# EAGLE design DAQ (EAGLE 7.2.0)
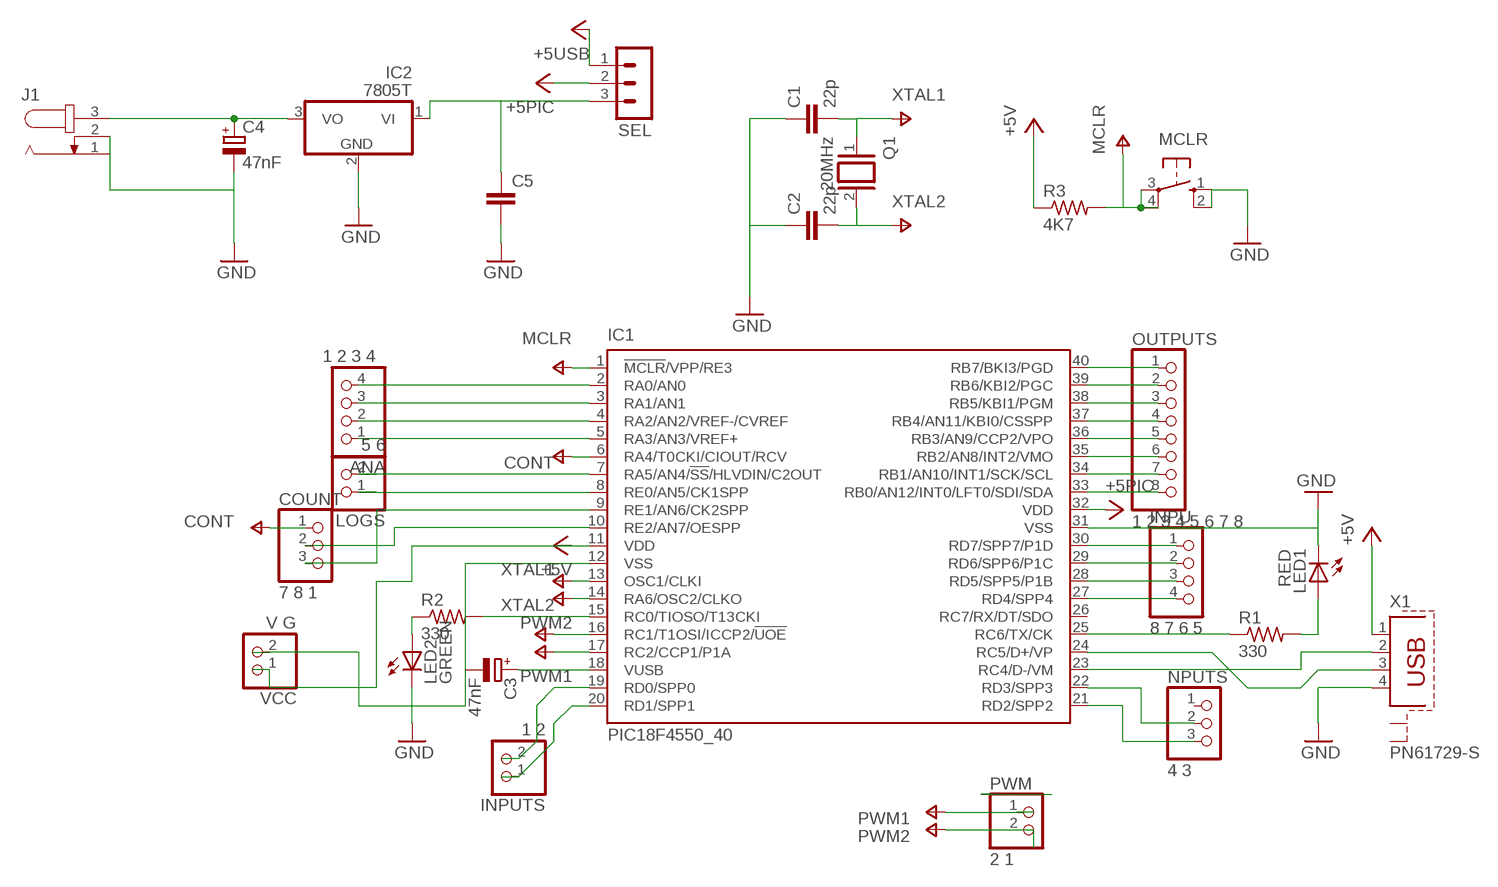
[diagram p0: schematic, sheet 1]

## Parts
ANA  1 2 3 4  PINHD-1X4  [1X04]
C1  22p  C-EU025-024X044  [C025-024X044]
C2  22p  C-EU025-024X044  [C025-024X044]
C3  47nF  CPOL-EUE2,5-6E  [E2,5-6E]
C4  47nF  CPOL-EUE2,5-6E  [E2,5-6E]
C5  C-EU050-035X075  [C050-035X075]
COUNT  7 8 1  PINHD-1X3  [1X03]
IC1  PIC18F4550_40  [DIL40]
IC2  7805T  [TO220H]
INPU  8 7 6 5  PINHD-1X4  [1X04]
INPUTS  1 2  PINHD-1X2  [1X02]
J1  JACK-PLUG0  [SPC4077]
LED1  RED  TLLR4400  [LED3MM]
LED2  GREEN  TLLG4400  [LED3MM]
LOGS  5 6  PINHD-1X2  [1X02]
MCLR  10-XX  [B3F-10XX]
NPUTS  4 3  PINHD-1X3  [1X03]
OUTPUTS  1 2 3 4 5 6 7 8  PINHD-1X8  [1X08]
PWM  2 1  PINHD-1X2  [1X02]
Q1  20MHz  XTAL/S  [QS]
R1  330  R-US_0207/10  [0207/10]
R2  330  R-US_0207/10  [0207/10]
R3  4K7  R-US_0207/10  [0207/10]
SEL  MA03-1  [MA03-1]
VCC  V G  PINHD-1X2  [1X02]
X1  PN61729-S  [PN61729-S]

## Nets
+5PIC: IC1.11(VDD) IC1.32(VDD) R3.1 SEL.2 VCC.1 ; supply symbol labelled +5V
+5USB: SEL.1 X1.1 ; supply symbol labelled +5V
CONT: COUNT.1 IC1.6(RA4/T0CKI/CIOUT/RCV)
GND: C1.1 C2.1 C3.- C4.- C5.2 IC1.12(VSS) IC1.31(VSS) IC2.2(GND) J1.1 J1.2 LED1.K(C) LED2.K(C) MCLR.1(S) MCLR.2(S1) VCC.2 X1.4
MCLR: IC1.1(!MCLR!/VPP/RE3) MCLR.3(P) MCLR.4(P1) R3.2
N$1: IC1.23(RC4/D-/VM) X1.2
N$2: IC1.30(RD7/SPP7/P1D) INPU.1
N$3: IC1.40(RB7/BKI3/PGD) OUTPUTS.1
N$4: IC1.15(RC0/TIOSO/T13CKI) R2.2
N$5: LED2.A R2.1
N$6: IC1.25(RC6/TX/CK) R1.1
N$7: LED1.A R1.2
N$8: IC1.39(RB6/KBI2/PGC) OUTPUTS.2
N$9: IC1.38(RB5/KBI1/PGM) OUTPUTS.3
N$10: IC1.37(RB4/AN11/KBI0/CSSPP) OUTPUTS.4
N$11: IC1.36(RB3/AN9/CCP2/VPO) OUTPUTS.5
N$12: IC1.35(RB2/AN8/INT2/VMO) OUTPUTS.6
N$13: IC1.34(RB1/AN10/INT1/SCK/SCL) OUTPUTS.7
N$14: IC1.33(RB0/AN12/INT0/LFT0/SDI/SDA) OUTPUTS.8
N$15: IC1.24(RC5/D+/VP) X1.3
N$16: IC1.29(RD6/SPP6/P1C) INPU.2
N$17: IC1.28(RD5/SPP5/P1B) INPU.3
N$18: IC1.27(RD4/SPP4) INPU.4
N$19: IC1.19(RD0/SPP0) INPUTS.2
N$20: C3.+ IC1.18(VUSB)
N$21: IC1.21(RD2/SPP2) NPUTS.3
N$22: IC1.22(RD3/SPP3) NPUTS.2
N$23: ANA.4 IC1.2(RA0/AN0)
N$24: ANA.3 IC1.3(RA1/AN1)
N$25: ANA.2 IC1.4(RA2/AN2/VREF-/CVREF)
N$26: ANA.1 IC1.5(RA3/AN3/VREF+)
N$27: IC1.7(RA5/AN4/!SS!/HLVDIN/C2OUT) LOGS.2
N$28: IC1.8(RE0/AN5/CK1SPP) LOGS.1
N$29: IC1.20(RD1/SPP1) INPUTS.1
N$31: COUNT.3 IC1.9(RE1/AN6/CK2SPP)
N$32: COUNT.2 IC1.10(RE2/AN7/OESPP)
N$131: C4.+ IC2.3(VO) J1.3
N$132: C5.1 IC2.1(VI) SEL.3
PWM1: IC1.17(RC2/CCP1/P1A) PWM.1
PWM2: IC1.16(RC1/T1OSI/ICCP2/!UOE) PWM.2
XTAL1: C1.2 IC1.13(OSC1/CLKI) Q1.1
XTAL2: C2.2 IC1.14(RA6/OSC2/CLKO) Q1.2
Unconnected: IC1.26(RC7/RX/DT/SDO) NPUTS.1 X1.S1 X1.S2

## Library data of the parts
ANA INPU = pinhead:PINHD-1X4: PIN HEADER
C1 C2 C5 = rcl:C-EU: CAPACITOR, European symbol
C3 C4 = resistor:CPOL-EU: POLARIZED CAPACITOR, European symbol
COUNT NPUTS = pinhead:PINHD-1X3: PIN HEADER
IC1 = microchip:PIC18F4*_40: USB Microcontrollers with nanoWatt Technology High-Performance, Enhanced Flash, 28/40/44-Pin, Source: http://ww1.microchip.com/downloads/en/devicedoc/39632c.pdf; MF: MICROCHIP; MPN: PIC18F4550-I/P; OC_FARNELL: 9321357; OC_NEWARK: 74K8623
IC2 = linear:78*: Positive VOLTAGE REGULATOR Source: http://cache.national.com/ds/LM/LM78L05.pdf http://www.fairchildsemi.com/ds/LM/LM7805.pdf
INPUTS LOGS PWM VCC = pinhead:PINHD-1X2: PIN HEADER
J1 = con-jack:JACK-PLUG: DC POWER JACK Power Jack, DC, Right Angle, Through Hole, Rated 5A at 16VDC, PC Terminals Distributor: Farnell (www.Farnell.de) Drawing: 84N1161.pdf / 84N1162.pdf Manufacturer: SPC Technology (www.spctechnology.com) Type: SPC4077 / SPC 4078; OC_FARNELL: unknown; OC_NEWARK: unknown
LED1 = led:TLLR4400: Low Current (2mA) LED 3 mm Tinted Diffused Package color RED Source: Data sheet <http://www.farnell.com/datasheets/391100.pdf>; MF: VISHAY SEMICONDUCTOR; OC_FARNELL: 1612437
LED2 = led:TLLG4400: Low Current (2mA) LED 3 mm Tinted Diffused Package color GREEN Source: Data sheet <http://www.farnell.com/datasheets/391098.pdf>; MF: VISHAY SEMICONDUCTOR; OC_FARNELL: 1612435
MCLR = switch-omron:10-XX: OMRON SWITCH; MPN: B3F-1000; OC_FARNELL: 176432; OC_NEWARK: 36M3542
OUTPUTS = pinhead:PINHD-1X8: PIN HEADER
Q1 = special:XTAL/S: CRYSTAL
R1-R3 = resistor:R-US_: RESISTOR, American symbol
SEL = con-lstb:MA03-1: PIN HEADER; OC_FARNELL: unknown; OC_NEWARK: unknown
X1 = con-berg:PN61729-S: BERG USB connector; OC_FARNELL: unknown; OC_NEWARK: unknown

## Board
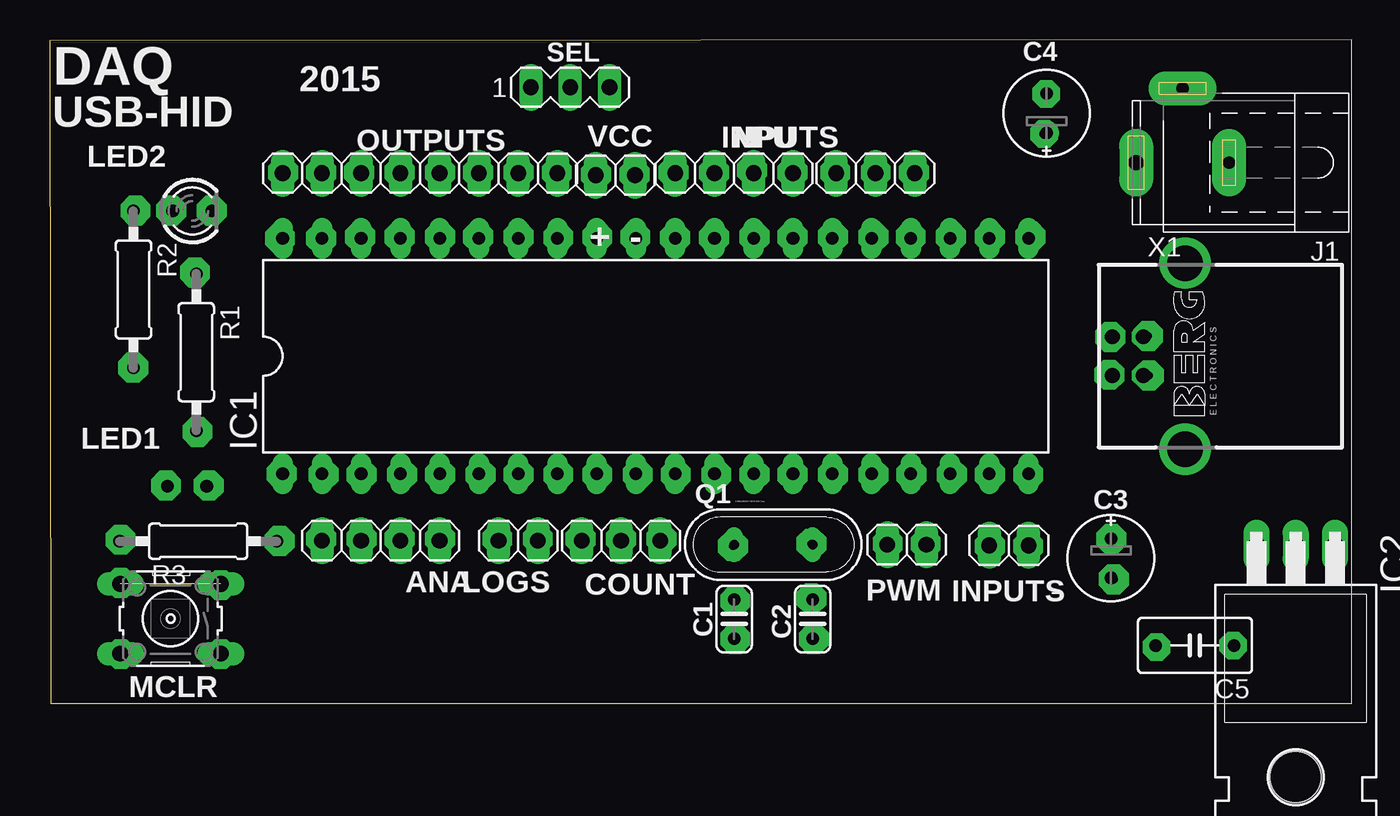
[diagram p1: board, top side]
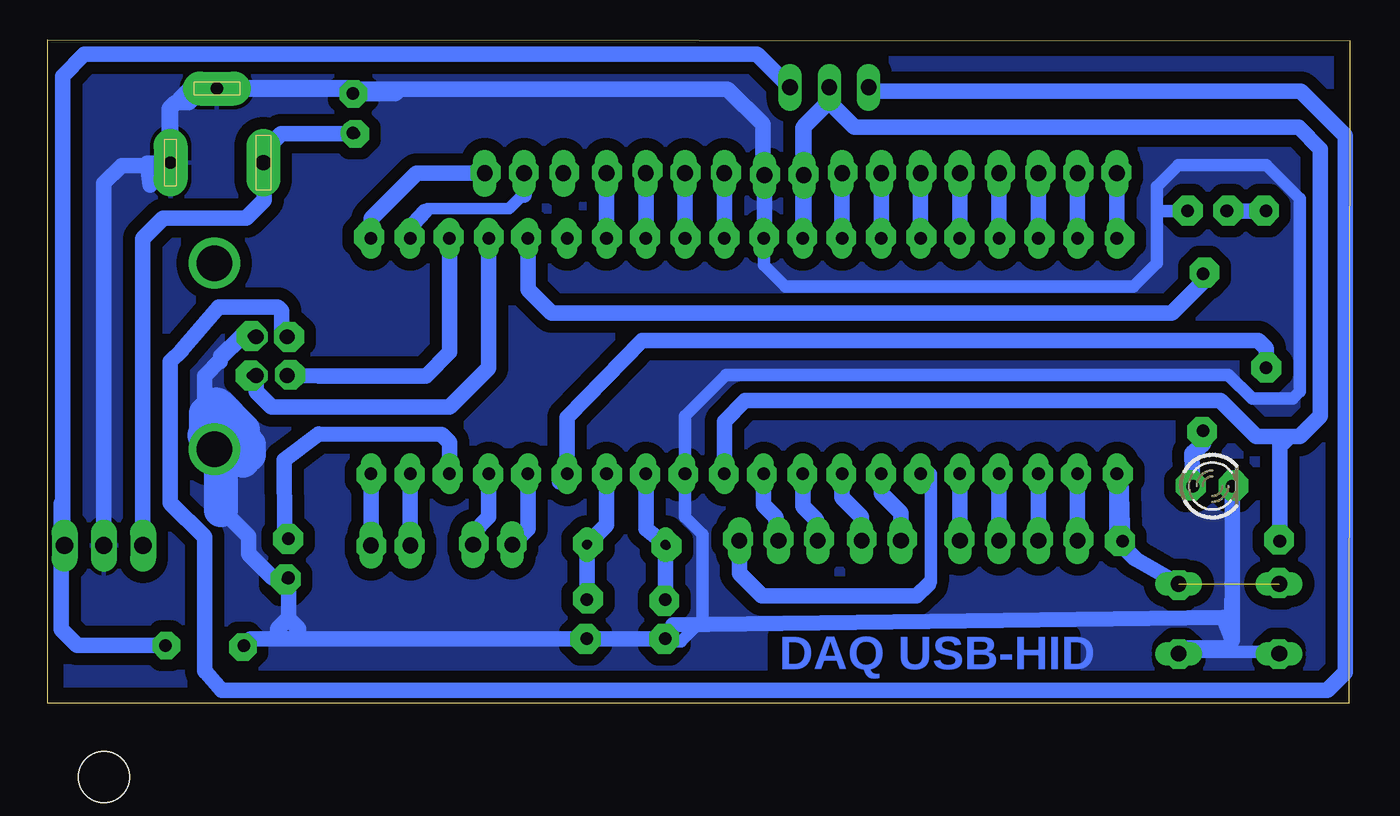
[diagram p2: board, bottom side, seen from below]

Size 84.24 x 42.93 mm. Coordinates in mm from the lower left corner, seen from the top.
Outline: 0.08,0 84.24,0 84.24,42.93 0,42.86 0.08,0
Copper layers (1*16): Top 0.035mm / dielectric 1.5mm / Bottom 0.035mm
Design rules "default *": minimum track width 10mil, minimum drill 24mil, track to track 30mil, track to pad 30mil, pad to pad 30mil, via to via 30mil, smd to smd 30mil, copper to edge 40mil, drill to drill 8mil, minimum pad ring 10mil, minimum via ring 8mil, stop-mask expansion 4mil, vias tented up to drill 0mil, thermal gap 10mil

### Footprints (pad centres in the part's own frame; a part is rotated, then mirrored left to right if it is on the bottom)
1X04 = drill 1.016 long: 1 -3.81,0; 2 -1.27,0; 3 1.27,0; 4 3.81,0
C025-024X044 = drill 0.813 octagon: 1 -1.27,0; 2 1.27,0
E2,5-6E = drill 0.813 pad 1.575: + -1.27,0 | drill 0.813 pad 1.575 octagon: - 1.27,0
C050-035X075 = drill 0.813 octagon: 1 -2.54,0; 2 2.54,0
1X03 = drill 1.016 long: 1 -2.54,0; 2 0,0; 3 2.54,0
DIL40 = drill 0.813 long: 1 -24.13,-7.62; 2 -21.59,-7.62; 3 -19.05,-7.62; 4 -16.51,-7.62; 5 -13.97,-7.62; 6 -11.43,-7.62; 7 -8.89,-7.62; 8 -6.35,-7.62; 9 -3.81,-7.62; 10 -1.27,-7.62; 11 1.27,-7.62; 12 3.81,-7.62; 13 6.35,-7.62; 14 8.89,-7.62; 15 11.43,-7.62; 16 13.97,-7.62; 17 16.51,-7.62; 18 19.05,-7.62; 19 21.59,-7.62; 20 24.13,-7.62; 21 24.13,7.62; 22 21.59,7.62; 23 19.05,7.62; 24 16.51,7.62; 25 13.97,7.62; 26 11.43,7.62; 27 8.89,7.62; 28 6.35,7.62; 29 3.81,7.62; 30 1.27,7.62; 31 -1.27,7.62; 32 -3.81,7.62; 33 -6.35,7.62; 34 -8.89,7.62; 35 -11.43,7.62; 36 -13.97,7.62; 37 -16.51,7.62; 38 -19.05,7.62; 39 -21.59,7.62; 40 -24.13,7.62
TO220H = drill 1.118 long: 1 -2.54,-10.16; 2 0,-10.16; 3 2.54,-10.16 | hole 3.302: 0,4.826
1X02 = drill 1.016 long: 1 -1.27,0; 2 1.27,0
SPC4077 = drill 0.8 pad 2.184 long: 1 -3,0; 2 0,-4.8 | drill 1 pad 2.184 long: 3 3,0
LED3MM = drill 0.813 octagon: A -1.27,0; K 1.27,0
B3F-10XX = drill 1.016 long: 1 -3.251,2.261; 2 3.251,2.261; 3 -3.251,-2.261; 4 3.251,-2.261
1X08 = drill 1.016 long: 1 -8.89,0; 2 -6.35,0; 3 -3.81,0; 4 -1.27,0; 5 1.27,0; 6 3.81,0; 7 6.35,0; 8 8.89,0
QS = drill 0.61 long: 1 -2.54,0; 2 2.54,0
0207/10 = drill 0.813 octagon: 1 -5.08,0; 2 5.08,0
MA03-1 = drill 1.016 long: 1 -2.54,0; 2 0,0; 3 2.54,0
PN61729-S = drill 0.95 octagon: 1 1.25,4.71; 2 -1.25,4.71; 3 -1.25,2.71; 4 1.25,2.71 | drill 2.3 pad 2.9: S1 -6.02,0; S2 6.02,0

### Placement (x,y rotation side)
ANA  21.42,10.52 180 top
C1  44.28,5.44 90 top
C2  49.36,5.44 90 top
C3  68.66,9.37 270 top
C4  64.5,38.18 90 top
C5  74.1,3.73 180 top
COUNT  36.96,10.52 180 top
IC1  39.2,22.45 0 top
IC2  80.61,0.04 180 top
INPU  44.28,34.29 0 top
INPUTS  62.06,10.21 180 top
J1  73.3,34.98 180 top
LED1  8.89,14.05 0 bottom
LED2  9.23,31.85 0 top
LOGS  30.31,10.52 180 top
MCLR  7.82,5.46 180 top
NPUTS  53.42,34.29 0 top
OUTPUTS  23.96,34.29 0 top
PWM  55.46,10.26 180 top
Q1  46.82,10.26 0 top
R1  9.48,22.71 270 top
R2  5.42,26.77 270 top
R3  9.61,10.48 0 top
SEL  33.68,39.85 0 top
VCC  36.6,34.16 0 top
X1  73.46,22.45 90 top

### Tracks (layer width: path | path; a pad name or v marks a point on that pad's centre or on a via)
+5PIC
  Bottom 1.016: SEL.2 33.68,38.98 35.31,37.34 35.31,34.18 VCC.1 35.33,30.14 IC1.32 35.39,37.22 33.56,39.05 | IC1.11 40.47,18.24 39.12,19.58 8.38,19.58 6.05,17.26 3.92,17.26 | 3.92,17.26 3.23,17.26 1.9,18.59 1.9,35.85 3.31,37.26 32.04,37.26 33.56,38.79 33.56,39.05 | R3.1 4.53,16.65 3.92,17.26 | 33.56,39.05 33.56,39.47
+5USB
  Bottom 1.016: SEL.1 30.89,39.85 30.63,39.59 3.16,39.59 0.3,36.73 0.3,1.98 1.44,0.84 73,0.84 73.99,1.98 74.1,2.1 74.1,10.74 76.31,12.95 76.31,22.1 75.59,22.82 75.59,22.86 73.19,25.64 69.38,25.64 69.11,25.37 69.11,24.06 X1.1
CONT
  Bottom 0.813: IC1.6 27.11,14.83 27.11,7.85 27.26,7.7
  Bottom 1.016: COUNT.1 39.5,8.38 38.04,6.93 28.03,6.93 27.26,7.7
GND
  Bottom 0.813: C1.1 44.11,4 43.28,4 41.89,5.39 41.89,10.93 43.01,12.05 IC1.12 43.01,18.59 40.35,21.25 7.86,21.25 6.32,19.71 3.7,19.71 3.24,20.17 3.24,32.64 5.4,34.8 11.09,34.8 12.48,33.41 12.48,32.03 | 12.48,32.03 12.48,28.49 14.02,26.95 36.5,26.95 37.89,28.33 37.89,30.03 IC1.31 | LED1.K 7.77,3.69 | 7.77,3.69 8.13,3.32 10.95,3.32 MCLR.1 | 7.77,3.69 10.85,3.69 11.21,3.32 4.69,3.32 MCLR.2 | LED2.K 12.3,31.85 12.48,32.03
  Bottom 1.016: X1.4 71.81,23.7 | 71.81,23.7 73.06,22.45 | VCC.2 37.87,33.6 | 37.87,33.6 37.87,30.14 IC1.31 | LED1.K 7.62,4.08 8.19,5.56 43.77,5.07 C1.1 C2.1 68.96,4.17 | 64.91,39.81 73.26,39.81 J1.2 73.49,39.59 75.2,39.59 76.3,38.49 J1.1 76.34,34.94 76.65,34.94 | 77.61,33.53 77.8,34.94 76.65,34.94 | 76.65,34.94 76.39,35.2 76.39,35.47 | 76.39,35.47 76.39,38.48 76.01,38.86 75.13,38.86 74.25,39.74 61.49,39.74 | 61.49,39.74 40.27,39.74 37.98,37.45 37.98,33.72 37.87,33.6 | IC2.2 80.62,33.64 79.47,34.79 77.07,34.79 76.39,35.47 | 68.96,4.17 71.13,4.17 C5.2 | 68.61,5.41 68.66,5.46 C3.- 69.71,8.1 71.24,9.64 71.24,10.78 72.88,12.42 72.96,12.42 | 68,4.8 68.61,5.41 | 68.61,5.41 68.77,5.41 69.38,4.8 69.38,4.58 68.96,4.17 | 71.81,23.7 71.81,23.63 73.03,22.4 | 74.1,17.34 74.1,21.18 73.07,22.21 | 73.07,22.21 73.07,22.29 71.62,23.74 | 73.07,22.1 73.07,22.21 | 71.62,23.74 71.43,23.93 71.05,23.93 70.86,23.74 71.62,23.74 | 72.96,12.42 73.03,12.42 73.15,12.53 73.07,12.53 72.96,12.42 | C4.- 61.78,39.45 61.49,39.74
  Bottom 2.184: 73.03,12.47 73.03,16.95 72,17.98 72,17.49 71.24,16.73 71.24,16.08 71.62,15.7 71.62,17.68 73.26,19.32 73.45,19.32 74.02,18.75 74.02,17.41 74.1,17.34
  pour Bottom: -0.86,42.95 -1.17,-0.14 84.12,-0.18 84.42,42.91
MCLR  (1 unrouted)
  Bottom 1.016: R3.2 14.82,14.58 IC1.1 15.07,10.52 13.88,9.32 MCLR.3
N$1
  Bottom 1.016: IC1.23 58.25,22.71 59.77,21.18 66.73,21.18 X1.2
N$2
  Bottom 1.016: INPU.1 IC1.30
N$3
  Bottom 1.016: OUTPUTS.1 IC1.40
N$4
  Bottom 1.016: R2.2 5.42,22.96 5.93,23.47 45.8,23.47 50.63,18.49 IC1.15 51.14,14.33
N$5
  Bottom 1.016: R2.1 LED2.A
N$6
  Bottom 1.016: R1.1 9.48,27.28 11.51,25.25 51.65,25.25 53.17,26.77 IC1.25
N$7
  Bottom 1.016: R1.2 9.48,16.76 10.23,16.17 LED1.A
N$8
  Bottom 1.016: OUTPUTS.2 IC1.39
N$9
  Bottom 1.016: OUTPUTS.3 IC1.38
N$10
  Bottom 1.016: OUTPUTS.4 IC1.37
N$11
  Bottom 1.016: OUTPUTS.5 IC1.36
N$12
  Bottom 1.016: OUTPUTS.6 IC1.35
N$13
  Bottom 1.016: OUTPUTS.7 IC1.34
N$14
  Bottom 1.016: OUTPUTS.8 IC1.33
N$15
  Bottom 1.016: IC1.24 55.71,21.69 58.25,19.15 69.76,19.15 70.76,20.15 X1.3
N$16
  Bottom 1.016: INPU.2 IC1.29
N$17
  Bottom 1.016: INPU.3 IC1.28
N$18
  Bottom 1.016: INPU.4 IC1.27
N$19
  Bottom 1.016: IC1.19 INPUTS.2
N$20
  Bottom 1.016: IC1.18 58.25,16.87 58.76,17.37 66.71,17.41 68.96,15.74 68.92,11.28 68.66,11.02 C3.+
N$21
  Bottom 1.016: 63.33,29.57 IC1.21 63.33,31.34 60.38,34.29 NPUTS.3
N$22
  Bottom 0.61: 53.42,32.87 53.68,32.87 53.68,32.72 | 59.67,32 59.88,31.8
  Bottom 0.75: 53.68,32.72 54.39,32 59.67,32
  Bottom 1.016: NPUTS.2 53.42,32.87 | 59.88,31.8 60.89,30.68 60.89,30.18 IC1.22
N$23
  Bottom 1.016: IC1.2 ANA.4
N$24
  Bottom 1.016: IC1.3 ANA.3
N$25
  Bottom 1.016: IC1.4 ANA.2
N$26
  Bottom 1.016: IC1.5 ANA.1
N$27
  Bottom 1.016: IC1.7 30.31,13.56 29.04,12.29 LOGS.2
N$28
  Bottom 1.016: IC1.8 32.85,13.31 31.58,12.04 LOGS.1
N$29
  Bottom 1.016: IC1.20 INPUTS.1
N$30
  pour Bottom: -0.6,43.24 -0.68,-0.18 84.32,-0.29 84.4,43.13
N$31
  Bottom 1.016: IC1.9 35.39,12.74 34.5,11.85 34.5,10.6 COUNT.3
N$32
  Bottom 1.016: IC1.10 37.93,12.82 37.12,12.01 37.12,10.36 | 37.12,9.85 37.12,10.36 | 37.12,10.36 COUNT.2
N$33  (via drill 0.5 pad 1.93)
  other vias: 14.9,30.08
N$34  (via drill 0.5 pad 1.93)
  other vias: 17.56,30.08
N$35  (via drill 0.5 pad 1.93)
  other vias: 20.08,30.18
N$36  (via drill 0.5 pad 1.93)
  other vias: 68.63,23.7
N$37  (via drill 0.5 pad 1.93)
  other vias: 71.06,23.76
N$38  (via drill 0.5 pad 1.93)
  other vias: 68.56,21.25
N$39  (via drill 0.5 pad 1.93)
  other vias: 71.11,21.2
N$40  (via drill 0.5 pad 1.93)
  other vias: 22.64,30.18
N$41  (via drill 0.5 pad 1.93)
  other vias: 25.26,30.18
N$42  (via drill 0.5 pad 1.93)
  other vias: 27.73,30.18
N$43  (via drill 0.5 pad 1.93)
  other vias: 30.34,30.18
N$44  (via drill 0.5 pad 1.93)
  other vias: 32.91,30.13
N$45  (via drill 0.5 pad 1.93)
  other vias: 35.43,30.18
N$46  (via drill 0.5 pad 1.93)
  other vias: 37.89,30.18
N$47  (via drill 0.5 pad 1.93)
  other vias: 40.45,30.13
N$48  (via drill 0.5 pad 1.93)
  other vias: 42.97,30.13
N$49  (via drill 0.5 pad 1.93)
  other vias: 45.59,30.18
N$50  (via drill 0.5 pad 1.93)
  other vias: 48.05,30.18
N$51  (via drill 0.5 pad 1.93)
  other vias: 50.67,30.18
N$52  (via drill 0.5 pad 1.93)
  other vias: 53.29,30.18
N$53  (via drill 0.5 pad 1.93)
  other vias: 55.7,30.18
N$54  (via drill 0.5 pad 1.93)
  other vias: 58.32,30.18
N$55  (via drill 0.5 pad 1.93)
  other vias: 60.84,30.18
N$56  (via drill 0.5 pad 1.93)
  other vias: 63.45,30.18
N$57  (via drill 0.5 pad 1.93)
  other vias: 55.91,34.34
N$58  (via drill 0.5 pad 1.93)
  other vias: 53.44,34.34
N$59  (via drill 0.5 pad 1.93)
  other vias: 50.83,34.34
N$60  (via drill 0.5 pad 1.93)
  other vias: 48.05,34.34
N$61  (via drill 0.5 pad 1.93)
  other vias: 45.44,34.49
N$62  (via drill 0.5 pad 1.93)
  other vias: 42.97,34.34
N$63  (via drill 0.5 pad 1.93)
  other vias: 40.35,34.34
N$64  (via drill 0.5 pad 1.93)
  other vias: 32.81,34.34
N$65  (via drill 0.5 pad 1.93)
  other vias: 30.34,34.34
N$66  (via drill 0.5 pad 1.93)
  other vias: 27.73,34.34
N$67  (via drill 0.5 pad 1.93)
  other vias: 25.26,34.34
N$68  (via drill 0.5 pad 1.93)
  other vias: 22.64,34.34
N$69  (via drill 0.5 pad 1.93)
  other vias: 20.03,34.34
N$70  (via drill 0.5 pad 1.93)
  other vias: 17.56,34.34
N$71  (via drill 0.5 pad 1.93)
  other vias: 15.1,34.34
N$72  (via drill 0.5 pad 1.93)
  other vias: 17.56,10.62
N$73  (via drill 0.5 pad 1.93)
  other vias: 20.18,10.62
N$74  (via drill 0.5 pad 1.93)
  other vias: 22.64,10.62
N$75  (via drill 0.5 pad 1.93)
  other vias: 25.26,10.62
N$76  (via drill 0.5 pad 1.93)
  other vias: 28.96,10.62
N$77  (via drill 0.5 pad 1.93)
  other vias: 31.58,10.62
N$78  (via drill 0.5 pad 1.93)
  other vias: 34.35,10.62
N$79  (via drill 0.5 pad 1.93)
  other vias: 36.97,10.62
N$80  (via drill 0.5 pad 1.93)
  other vias: 39.58,10.62
N$81  (via drill 0.5 pad 1.93)
  other vias: 44.2,10.16
N$82  (via drill 0.5 pad 1.93)
  other vias: 49.29,10.31
N$83  (via drill 0.5 pad 1.93)
  other vias: 44.36,6.62
N$84  (via drill 0.5 pad 1.93)
  other vias: 44.36,4.15
N$85  (via drill 0.5 pad 1.93)
  other vias: 49.44,4.15
N$86  (via drill 0.5 pad 1.93)
  other vias: 49.29,6.77
N$87  (via drill 0.5 pad 1.93)
  other vias: 54.21,10.31
N$88  (via drill 0.5 pad 1.93)
  other vias: 56.68,10.31
N$89  (via drill 0.5 pad 1.93)
  other vias: 60.84,10.16
N$90  (via drill 0.5 pad 1.93)
  other vias: 63.3,10.16
N$91  (via drill 0.5 pad 1.93)
  other vias: 68.69,10.62
N$92  (via drill 0.5 pad 1.93)
  other vias: 68.84,8
N$93  (via drill 0.5 pad 1.93)
  other vias: 9.4,27.87
N$94  (via drill 0.5 pad 1.93)
  other vias: 5.55,31.87
N$95  (via drill 0.5 pad 1.93)
  other vias: 7.86,31.87
N$96  (via drill 0.5 pad 1.93)
  other vias: 10.48,31.87
N$97  (via drill 0.5 pad 1.93)
  other vias: 9.55,17.55
N$98  (via drill 0.5 pad 1.93)
  other vias: 5.4,21.71
N$99  (via drill 0.5 pad 1.93)
  other vias: 4.59,7.79
N$100  (via drill 0.5 pad 1.93)
  other vias: 4.59,3.17
N$101  (via drill 0.5 pad 1.93)
  other vias: 11.06,3.17
N$102  (via drill 0.5 pad 1.93)
  other vias: 11.06,7.64
N$103  (via drill 0.5 pad 1.93)
  other vias: 10.29,14.08
N$104  (via drill 0.5 pad 1.93)
  other vias: 7.52,14.08
N$105  (via drill 0.5 pad 1.93)
  other vias: 14.87,10.49
N$106  (via drill 0.5 pad 1.93)
  other vias: 4.58,10.57
N$107  (via drill 0.5 pad 1.93)
  other vias: 15,14.83
N$108  (via drill 0.5 pad 1.93)
  other vias: 17.72,14.78
N$109  (via drill 0.5 pad 1.93)
  other vias: 20.18,14.78
N$110  (via drill 0.5 pad 1.93)
  other vias: 22.8,14.78
N$111  (via drill 0.5 pad 1.93)
  other vias: 25.26,14.78
N$112  (via drill 0.5 pad 1.93)
  other vias: 27.88,14.78
N$113  (via drill 0.5 pad 1.93)
  other vias: 30.34,14.78
N$114  (via drill 0.5 pad 1.93)
  other vias: 32.91,14.78
N$115  (via drill 0.5 pad 1.93)
  other vias: 35.43,14.78
N$116  (via drill 0.5 pad 1.93)
  other vias: 38.04,14.78
N$117  (via drill 0.5 pad 1.93)
  other vias: 40.51,14.78
N$118  (via drill 0.5 pad 1.93)
  other vias: 43.13,14.78
N$119  (via drill 0.5 pad 1.93)
  other vias: 45.59,14.78
N$120  (via drill 0.5 pad 1.93)
  other vias: 48.05,14.78
N$121  (via drill 0.5 pad 1.93)
  other vias: 50.67,14.78
N$122  (via drill 0.5 pad 1.93)
  other vias: 53.29,14.78
N$123  (via drill 0.5 pad 1.93)
  other vias: 55.75,14.78
N$124  (via drill 0.5 pad 1.93)
  other vias: 58.37,14.78
N$125  (via drill 0.5 pad 1.93)
  other vias: 60.84,14.78
N$126  (via drill 0.5 pad 1.93)
  other vias: 63.3,14.78
N$127  (via drill 1.1 pad 1.78)
  other vias: 73.45,28.46
N$128  (via drill 1.1 pad 1.78)
  other vias: 73.45,16.46
N$129  (via drill 0.5 pad 1.93)
  other vias: 35.35,34.21
N$130  (via drill 0.5 pad 1.93)
  other vias: 37.85,34.21
N$131
  Bottom 1.016: 69.82,35.46 J1.3 | J1.3 70.25,34.93 70.25,32.54 71.4,31.39 76.77,31.39 78.1,30.06 78.1,10.22 IC2.3 | J1.3 70.3,35.69 69.15,36.84 64.52,36.84 64.52,36.88 C4.+
N$132
  Bottom 1.016: SEL.3 38.35,41.99 81.87,41.99 83.28,40.58 83.28,10.07 | C5.1 82.33,3.73 83.36,4.76 83.36,9.64 | 83.36,9.64 83.36,12.92 | 83.36,9.64 83.28,9.72 83.28,10.07 | 83.28,10.07 IC2.1
N$133  (via drill 0.6 pad 1.78)
  other vias: 64.35,36.84
N$134  (via drill 0.6 pad 1.78)
  other vias: 64.46,39.43
N$135  (via drill 0.6 pad 1.78)
  other vias: 76.58,3.73
N$136  (via drill 0.6 pad 1.78)
  other vias: 71.62,3.62
PWM1
  Bottom 1.016: IC1.17 55.71,12.04 56.73,11.02 PWM.1 56.73,9.5
PWM2
  Bottom 1.016: IC1.16 53.17,11.28 PWM.2
XTAL1
  Bottom 1.016: C1.2 Q1.1 45.55,11.28 IC1.13
XTAL2
  Bottom 1.016: C2.2 Q1.2 48.09,11.53 IC1.14

### Text on the board
Bottom: DAQ USB-HID
tPlace: DAQ | 2015 | USB-HID
tNames: + | - | D:/IMAGENES/UDP MICROCHIP.bmp